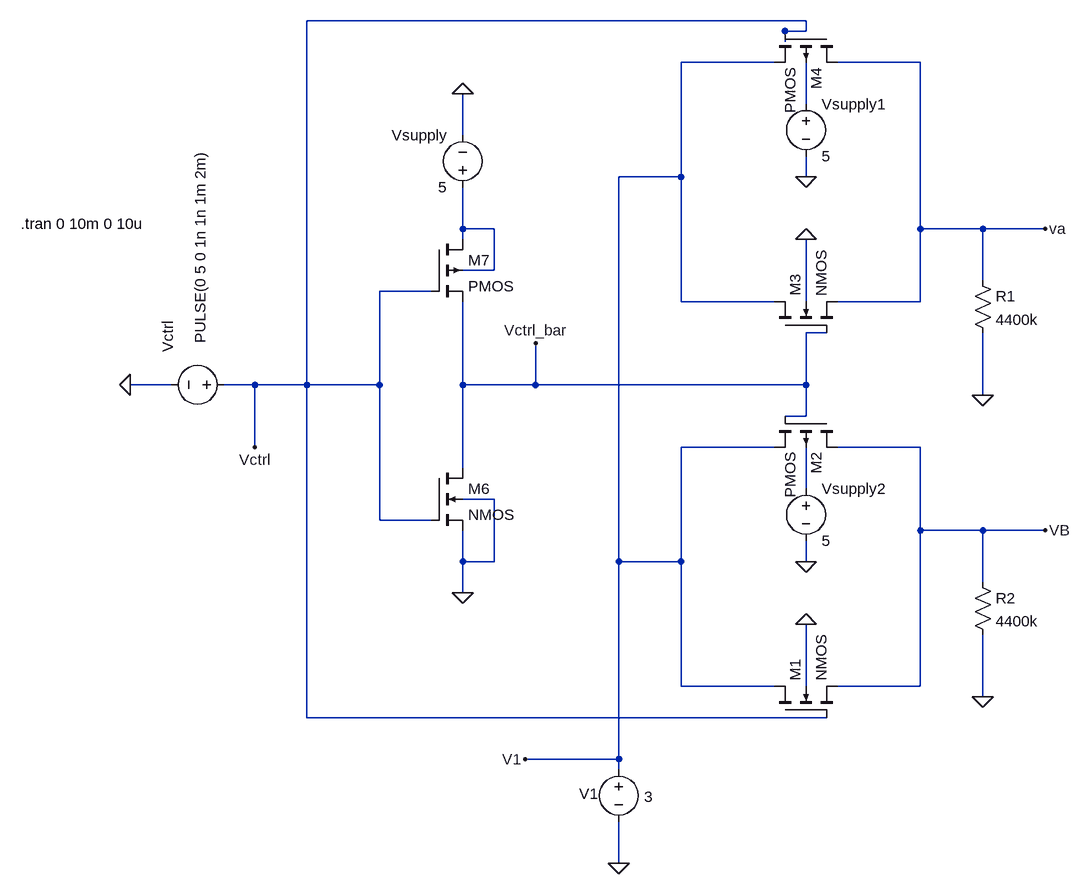
[diagram p0: schematic Switch 2.asc]
Switch 2.asc, the LTspice schematic file:
Version 4.1
SHEET 1 1760 1076
WIRE 656 -336 -112 -336
WIRE 656 -320 656 -336
WIRE 656 -320 624 -320
WIRE 624 -304 624 -320
WIRE 608 -272 464 -272
WIRE 832 -272 704 -272
WIRE 656 -208 656 -272
WIRE 128 -160 128 -224
WIRE 464 -96 464 -272
WIRE 464 -96 368 -96
WIRE 656 -96 656 -128
WIRE 128 -16 128 -80
WIRE 176 -16 128 -16
WIRE 832 -16 832 -272
WIRE 928 -16 832 -16
WIRE 1024 -16 928 -16
WIRE 128 0 128 -16
WIRE 176 48 176 -16
WIRE 176 48 128 48
WIRE 928 64 928 -16
WIRE 80 80 0 80
WIRE 464 96 464 -96
WIRE 608 96 464 96
WIRE 656 96 656 0
WIRE 832 96 832 -16
WIRE 832 96 704 96
WIRE 688 144 656 144
WIRE -320 224 -384 224
WIRE -192 224 -240 224
WIRE -112 224 -112 -336
WIRE -112 224 -192 224
WIRE 0 224 0 80
WIRE 0 224 -112 224
WIRE 128 224 128 96
WIRE 240 224 240 160
WIRE 240 224 128 224
WIRE 656 224 656 144
WIRE 656 224 240 224
WIRE 928 240 928 144
WIRE 656 272 656 224
WIRE 656 272 624 272
WIRE -192 320 -192 224
WIRE 608 320 464 320
WIRE 832 320 704 320
WIRE 128 352 128 224
WIRE 656 384 656 320
WIRE 176 400 128 400
WIRE 0 432 0 224
WIRE 80 432 0 432
WIRE 832 448 832 320
WIRE 928 448 832 448
WIRE 1024 448 928 448
WIRE 128 496 128 448
WIRE 176 496 176 400
WIRE 176 496 128 496
WIRE 368 496 368 -96
WIRE 464 496 464 320
WIRE 464 496 368 496
WIRE 656 496 656 464
WIRE 928 528 928 448
WIRE 128 544 128 496
WIRE 464 688 464 496
WIRE 608 688 464 688
WIRE 656 688 656 592
WIRE 832 688 832 448
WIRE 832 688 704 688
WIRE 928 704 928 608
WIRE -112 736 -112 224
WIRE 688 736 -112 736
WIRE 368 800 368 496
WIRE 368 800 224 800
WIRE 368 816 368 800
WIRE 368 960 368 896
FLAG 928 240 0
FLAG 1024 -16 va
FLAG 656 0 0
FLAG 928 704 0
FLAG 1024 448 VB
FLAG 656 592 0
FLAG 240 160 Vctrl_bar
FLAG 128 544 0
FLAG -384 224 0
FLAG 368 960 0
FLAG 128 -224 0
FLAG 656 -96 0
FLAG 656 496 0
FLAG 224 800 V1
FLAG -192 320 Vctrl
SYMBOL res 912 48 R0
SYMATTR InstName R1
SYMATTR Value 4400k
SYMBOL nmos4 608 144 R270
SYMATTR InstName M3
SYMBOL pmos4 704 -320 R90
SYMATTR InstName M4
SYMBOL voltage 368 800 R0
WINDOW 0 -46 69 Bottom 2
WINDOW 3 46 42 Top 2
WINDOW 123 0 0 Left 0
WINDOW 39 0 0 Left 0
SYMATTR InstName V1
SYMATTR Value 3
SYMBOL res 912 512 R0
SYMATTR InstName R2
SYMATTR Value 4400k
SYMBOL voltage -224 224 R90
WINDOW 0 -98 102 Left 2
WINDOW 3 -361 52 Left 2
WINDOW 123 0 0 Left 0
WINDOW 39 0 0 Left 0
SYMATTR InstName Vctrl
SYMATTR Value PULSE(0 5 0 1n 1n 1m 2m)
SYMBOL nmos4 608 736 R270
SYMATTR InstName M1
SYMBOL pmos4 704 272 R90
SYMATTR InstName M2
SYMBOL pmos4 80 0 R0
SYMATTR InstName M7
SYMBOL nmos4 80 352 R0
SYMATTR InstName M6
SYMBOL voltage 128 -64 R180
WINDOW 0 24 96 Left 2
WINDOW 3 24 16 Left 2
SYMATTR InstName Vsupply
SYMATTR Value 5
SYMBOL voltage 656 -224 R0
SYMATTR InstName Vsupply1
SYMATTR Value 5
SYMBOL voltage 656 368 R0
SYMATTR InstName Vsupply2
SYMATTR Value 5
TEXT -552 -24 Left 2 !.tran 0 10m 0 10u

The netlist it stands for:
* Switch 2.asc
R1 va 0 4400k
M3 V1 Vctrl_bar va 0 NMOS
M4 va Vctrl V1 N001 PMOS
V1 V1 0 3
R2 VB 0 4400k
Vctrl Vctrl 0 PULSE(0 5 0 1n 1n 1m 2m)
M1 V1 Vctrl VB 0 NMOS
M2 VB Vctrl_bar V1 N003 PMOS
M7 N002 Vctrl Vctrl_bar N002 PMOS
M6 Vctrl_bar Vctrl 0 0 NMOS
Vsupply N002 0 5
Vsupply1 N001 0 5
Vsupply2 N003 0 5
.model NMOS NMOS
.model PMOS PMOS
.lib standard.mos
.tran 0 10m 0 10u
.backanno
.end